# EAGLE schematic FishTankControllerV2 (EAGLE 9.6.2)
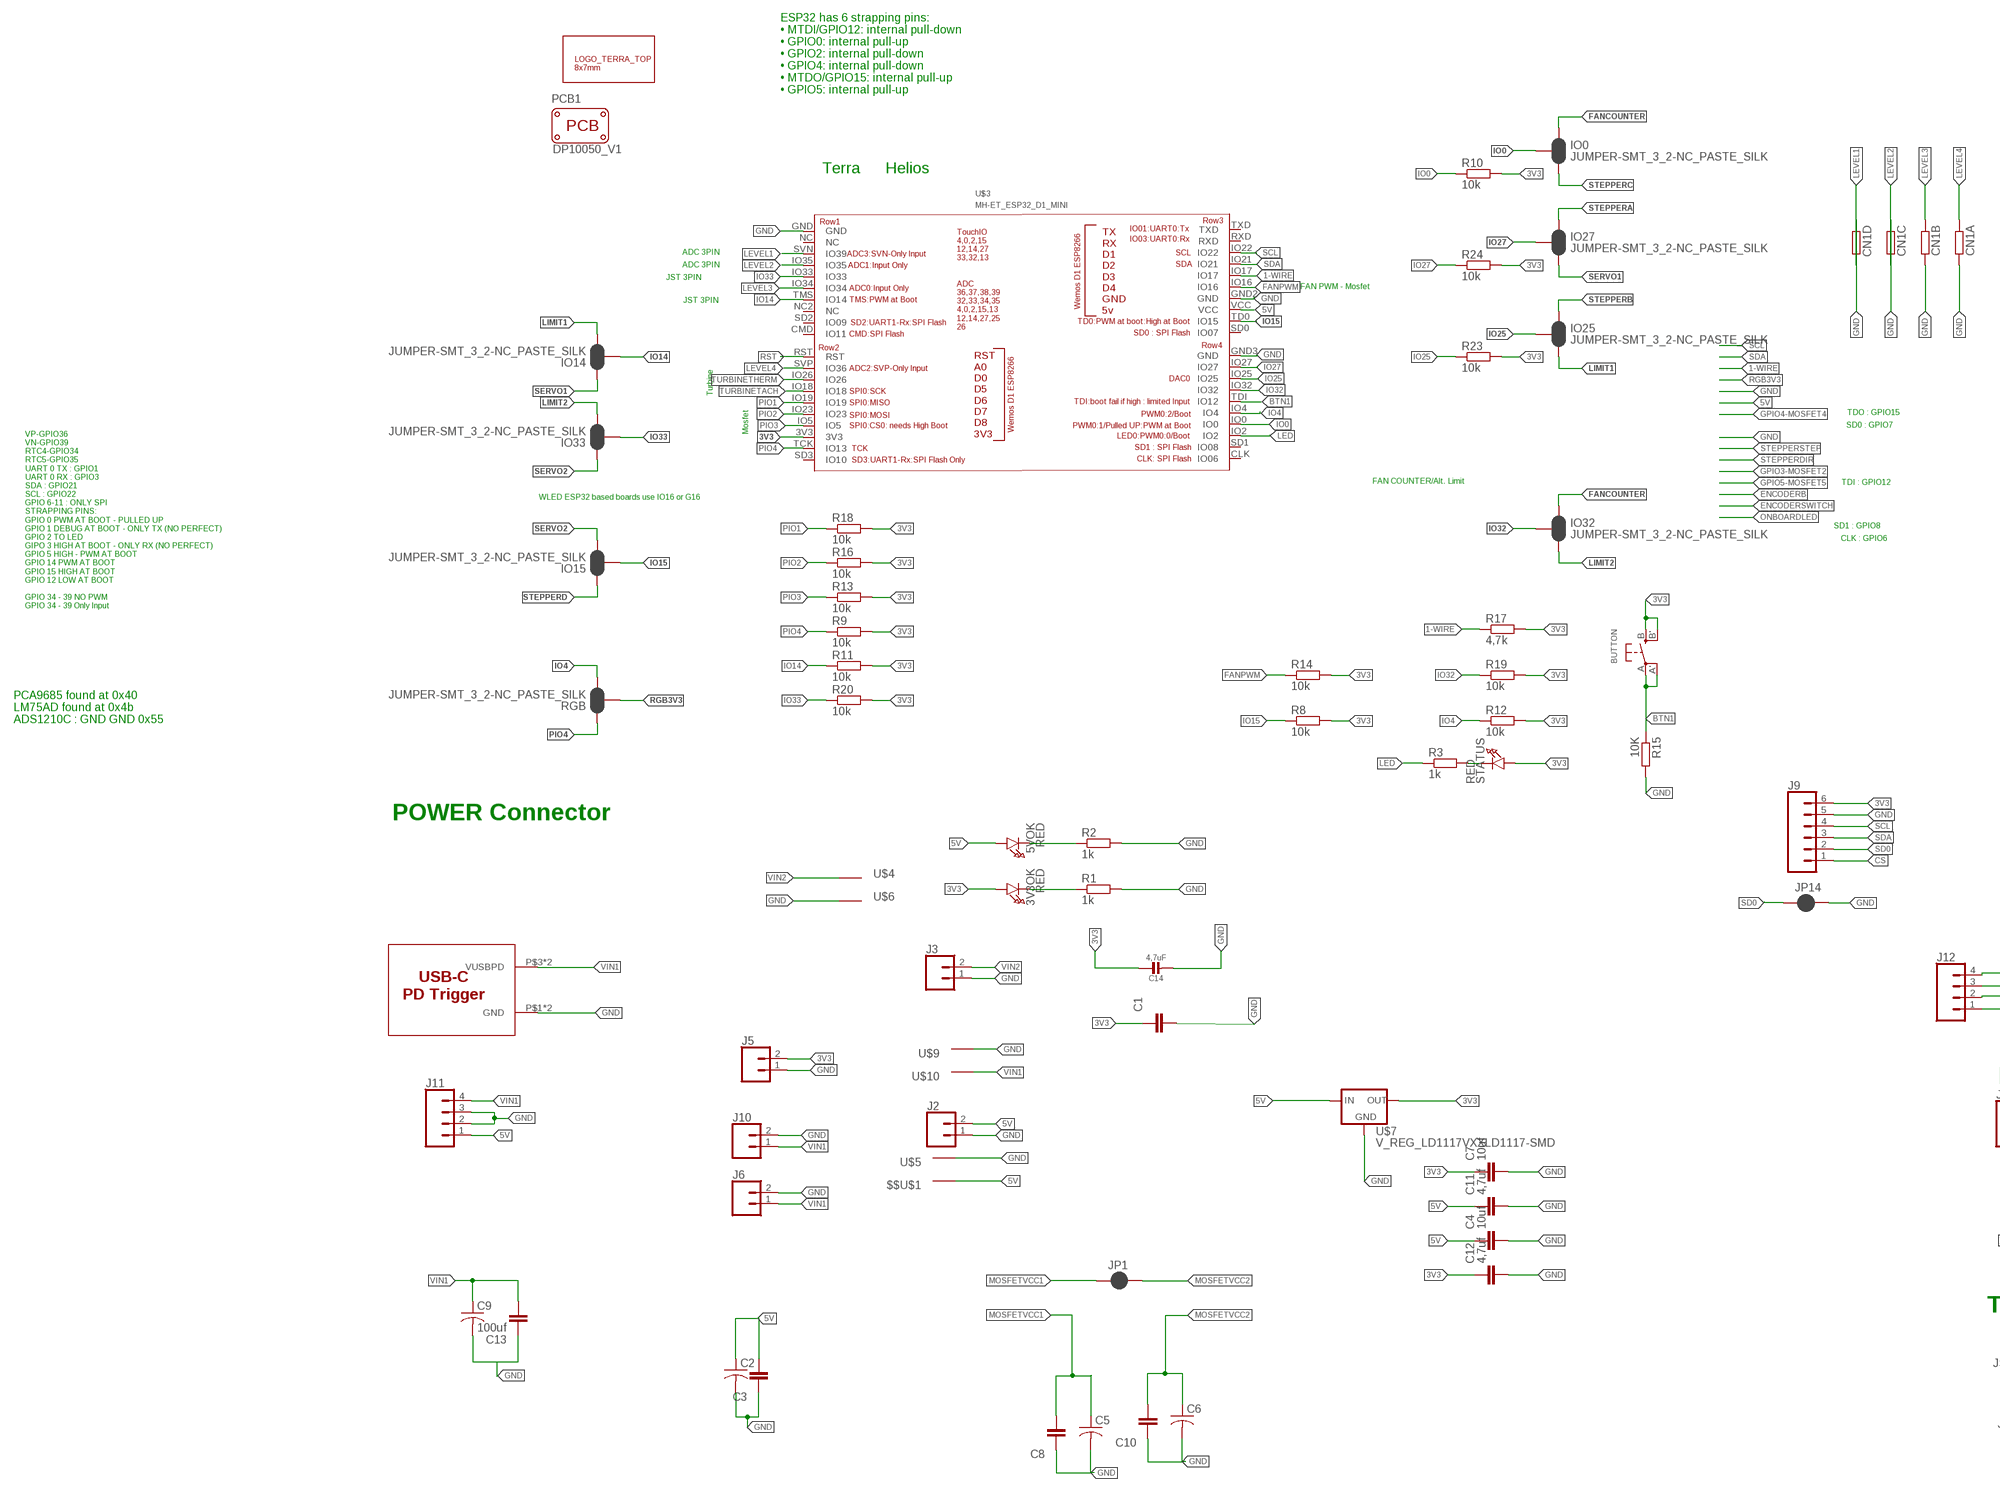
[diagram p0: schematic, sheet 1, part 1 of 2]
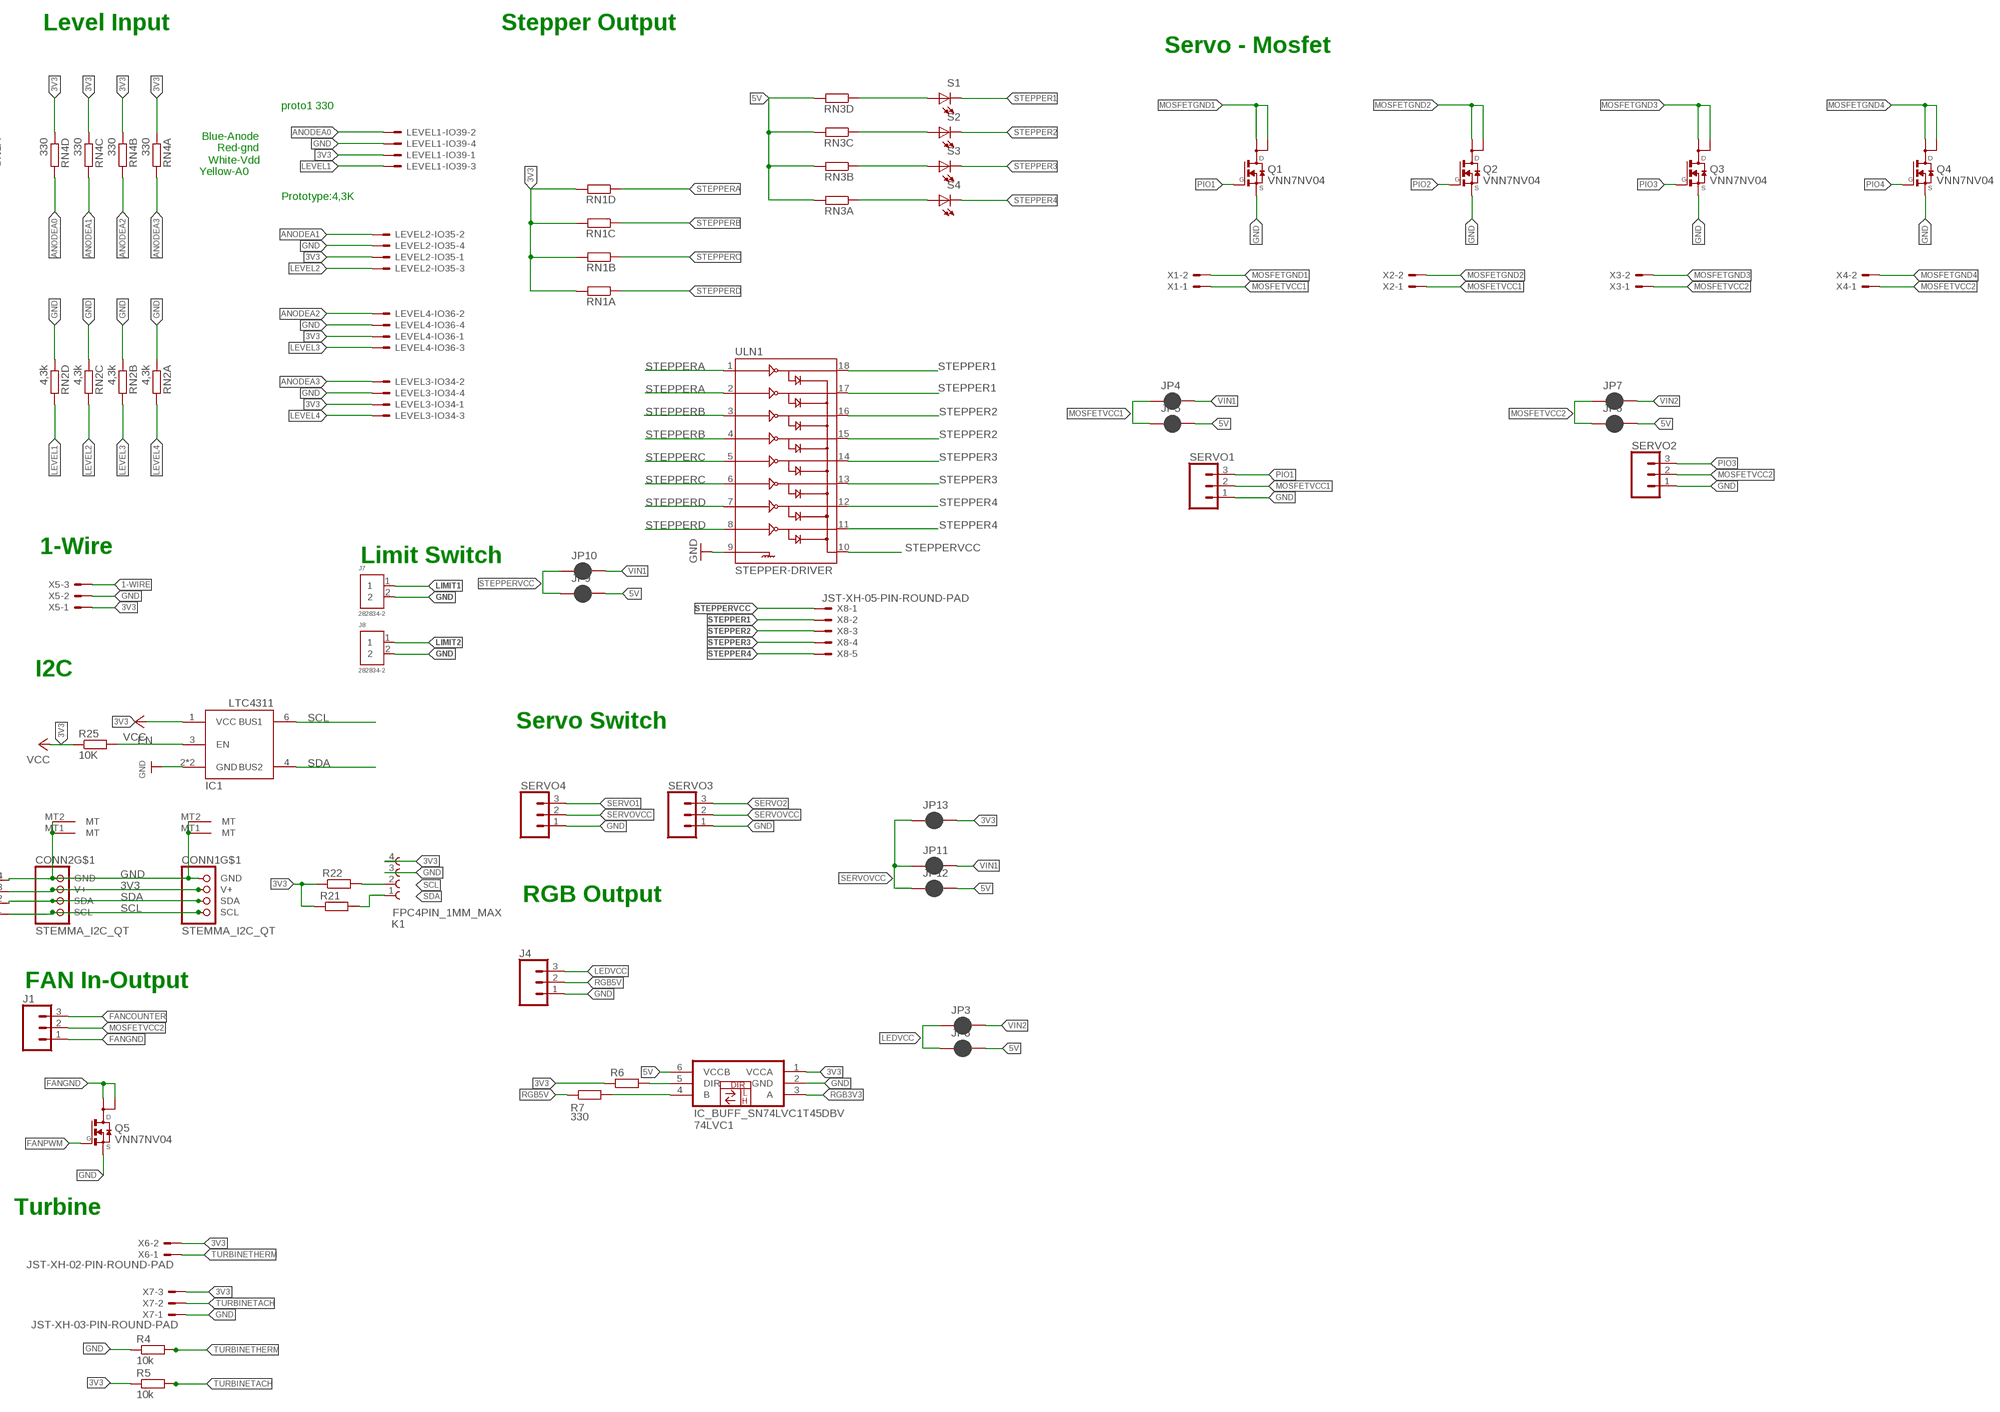
[diagram p1: schematic, sheet 1, part 2 of 2]

## Parts
3V3OK  RED  LED0805  [CHIPLED_0805]
5VOK  RED  LED0805  [CHIPLED_0805]
74LVC1  IC_BUFF_SN74LVC1T45DBV  [DBV-R-PDSO-G6]
$$U$1  TESTHOOK  [TESTHOOK]
BUTTON  KMR2  SWITCH_TACT_SMT4.6X2.8  [BTN_KMR2_4.6X2.8]
C1  CAPACITOR_NPOL-0805  [C805]
C2  C-USC1210  [C1210]
C3  CAPACITOR_NPOL-0805  [C805]
C4  10uf  CAPACITOR_NPOL-0805  [C805]
C5  C-USC1210  [C1210]
C6  C-USC1210  [C1210]
C7  10uf  CAPACITOR_NPOL-0805  [C805]
C8  CAPACITOR_NPOL-0805  [C805]
C9  100uf  C-USC1210  [C1210]
C10  CAPACITOR_NPOL-0805  [C805]
C11  4,7uf  CAPACITOR_NPOL-0805  [C805]
C12  4,7uf  CAPACITOR_NPOL-0805  [C805]
C13  CAPACITOR_NPOL-0805  [C805]
C14  4,7uF  CAP_CERAMIC0805-NOOUTLINE  [0805-NO]
CN1  RESISTOR_ARRAY_4  [RN8P-4R-CRA06S]
CONN1  STEMMA_I2C_QT  [JST_SH4]
CONN2  STEMMA_I2C_QT  [JST_SH4]
IC1  LTC4311_SC70  [SC70-6L]
IO0  JUMPER-SMT_3_2-NC_PASTE_SILK  [SMT-JUMPER_3_2-NC_PASTE_SILK]
IO14  JUMPER-SMT_3_2-NC_PASTE_SILK  [SMT-JUMPER_3_2-NC_PASTE_SILK]
IO15  JUMPER-SMT_3_2-NC_PASTE_SILK  [SMT-JUMPER_3_2-NC_PASTE_SILK]
IO25  JUMPER-SMT_3_2-NC_PASTE_SILK  [SMT-JUMPER_3_2-NC_PASTE_SILK]
IO27  JUMPER-SMT_3_2-NC_PASTE_SILK  [SMT-JUMPER_3_2-NC_PASTE_SILK]
IO32  JUMPER-SMT_3_2-NC_PASTE_SILK  [SMT-JUMPER_3_2-NC_PASTE_SILK]
IO33  JUMPER-SMT_3_2-NC_PASTE_SILK  [SMT-JUMPER_3_2-NC_PASTE_SILK]
J1  CONN_03POLAR  [MOLEX-1X3]
J2  CONN_02POLAR  [MOLEX-1X2]
J3  CONN_02POLAR  [MOLEX-1X2]
J4  CONN_03SCREW  [SCREWTERMINAL-3.5MM-3]
J5  CONN_02POLAR  [MOLEX-1X2]
J6  CONN_023.5MM  [SCREWTERMINAL-3.5MM-2]
J7  282834-2  [CONN_282834-2]
J8  282834-2  [CONN_282834-2]
J9  CONN_06NO_SILK_FEMALE_PTH  [1X06_NO_SILK]
J10  CONN_023.5MM  [SCREWTERMINAL-3.5MM-2]
J11  CONN_04  [1X04]
J12  CONN_04JST-PH-4-1.0MM  [JST-4-SMD-VERT-1.0MM]
JP1  JUMPER-SMT_2_NC_PASTE_SILK  [SMT-JUMPER_2_NC_PASTE_SILK]
JP3  JUMPER-SMT_2_NC_PASTE_SILK  [SMT-JUMPER_2_NC_PASTE_SILK]
JP4  JUMPER-SMT_2_NC_PASTE_SILK  [SMT-JUMPER_2_NC_PASTE_SILK]
JP5  JUMPER-SMT_2_NC_PASTE_SILK  [SMT-JUMPER_2_NC_PASTE_SILK]
JP6  JUMPER-SMT_2_NC_PASTE_SILK  [SMT-JUMPER_2_NC_PASTE_SILK]
JP7  JUMPER-SMT_2_NC_PASTE_SILK  [SMT-JUMPER_2_NC_PASTE_SILK]
JP8  JUMPER-SMT_2_NC_PASTE_SILK  [SMT-JUMPER_2_NC_PASTE_SILK]
JP9  JUMPER-SMT_2_NC_PASTE_SILK  [SMT-JUMPER_2_NC_PASTE_SILK]
JP10  JUMPER-SMT_2_NC_PASTE_SILK  [SMT-JUMPER_2_NC_PASTE_SILK]
JP11  JUMPER-SMT_2_NC_PASTE_SILK  [SMT-JUMPER_2_NC_PASTE_SILK]
JP12  JUMPER-SMT_2_NC_PASTE_SILK  [SMT-JUMPER_2_NC_PASTE_SILK]
JP13  JUMPER-SMT_2_NC_PASTE_SILK  [SMT-JUMPER_2_NC_PASTE_SILK]
JP14  JUMPER-SMT_2_NC_PASTE_SILK  [SMT-JUMPER_2_NC_PASTE_SILK]
K1  FPC4PIN_1MM_MAX  [FPC_CONN_DOC_4PIN_ENLARGED]
LEVEL1-IO39  JST-XH-04-PIN-ROUND-PAD  [JST-XH-04-PACKAGE-ROUND-PAD]
LEVEL2-IO35  JST-XH-04-PIN-ROUND-PAD  [JST-XH-04-PACKAGE-ROUND-PAD]
LEVEL3-IO34  JST-XH-04-PIN-ROUND-PAD  [JST-XH-04-PACKAGE-ROUND-PAD]
LEVEL4-IO36  JST-XH-04-PIN-ROUND-PAD  [JST-XH-04-PACKAGE-ROUND-PAD]
PCB1  PCB_DP_RECTANGLE-50X100  [DP10050_V1]
Q1  VNN7NV04  [SOT223]
Q2  VNN7NV04  [SOT223]
Q3  VNN7NV04  [SOT223]
Q4  VNN7NV04  [SOT223]
Q5  VNN7NV04  [SOT223]
R1  1k  RESISTORR805-0805  [R805]
R2  1k  RESISTORR805-0805  [R805]
R3  1k  RESISTORR805-0805  [R805]
R4  10k  RESISTORR805-0805  [R805]
R5  10k  RESISTORR805-0805  [R805]
R6  RESISTORR805-0805  [R805]
R7  330  RESISTORR805-0805  [R805]
R8  10k  RESISTORR805-0805  [R805]
R9  10k  RESISTORR805-0805  [R805]
R10  10k  RESISTORR805-0805  [R805]
R11  10k  RESISTORR805-0805  [R805]
R12  10k  RESISTORR805-0805  [R805]
R13  10k  RESISTORR805-0805  [R805]
R14  10k  RESISTORR805-0805  [R805]
R15  10K  RESISTORR805-0805  [R805]
R16  10k  RESISTORR805-0805  [R805]
R17  4,7k  RESISTORR805-0805  [R805]
R18  10k  RESISTORR805-0805  [R805]
R19  10k  RESISTORR805-0805  [R805]
R20  10k  RESISTORR805-0805  [R805]
R21  RESISTORR805-0805  [R805]
R22  RESISTORR805-0805  [R805]
R23  10k  RESISTORR805-0805  [R805]
R24  10k  RESISTORR805-0805  [R805]
R25  10K  RESISTORR805-0805  [R805]
RGB  JUMPER-SMT_3_2-NC_PASTE_SILK  [SMT-JUMPER_3_2-NC_PASTE_SILK]
RN1  RESISTOR_ARRAY_4  [RN8P-4R-CRA06S]
RN2  4,3k  RESISTOR_ARRAY_4  [RN8P-4R-CRA06S]
RN3  RESISTOR_ARRAY_4  [RN8P-4R-CRA06S]
RN4  330  RESISTOR_ARRAY_4  [RN8P-4R-CRA06S]
S1  LED-0805  [LED-805]
S2  LED-0805  [LED-805]
S3  LED-0805  [LED-805]
S4  LED-0805  [LED-805]
SERVO1  CONN_03POLAR  [MOLEX-1X3]
SERVO2  CONN_03POLAR  [MOLEX-1X3]
SERVO3  CONN_03POLAR  [MOLEX-1X3]
SERVO4  CONN_03POLAR  [MOLEX-1X3]
STATUS  RED  LED0805  [CHIPLED_0805]
U$1  LOGOTOPTERRA  [LOGOTOPTERRA]
U$3  MH-ET_ESP32_D1_MINI  [MH-ET_ESP32_D1_MINI]
U$4  TESTHOOK  [TESTHOOK]
U$5  TESTHOOK  [TESTHOOK]
U$6  TESTHOOK  [TESTHOOK]
U$7  V_REG_LD1117VXXLD1117-SMD  [SOT223]
U$8  USB_PD_TRIGGER  [USB-PDTRIGGER]
U$9  TESTHOOK  [TESTHOOK]
U$10  TESTHOOK  [TESTHOOK]
ULN1  STEPPER-DRIVER  ULN2803SOICW  [SO18L]
X1  JST-XH-02-PIN-ROUND-PAD  [JST-XH-02-PACKAGE-ROUND-PAD]
X2  JST-XH-02-PIN-ROUND-PAD  [JST-XH-02-PACKAGE-ROUND-PAD]
X3  JST-XH-02-PIN-ROUND-PAD  [JST-XH-02-PACKAGE-ROUND-PAD]
X4  JST-XH-02-PIN-ROUND-PAD  [JST-XH-02-PACKAGE-ROUND-PAD]
X5  JST-XH-03-PIN-ROUND-PAD  [JST-XH-03-PACKAGE-ROUND-PAD]
X6  JST-XH-02-PIN-ROUND-PAD  [JST-XH-02-PACKAGE-ROUND-PAD]
X7  JST-XH-03-PIN-ROUND-PAD  [JST-XH-03-PACKAGE-ROUND-PAD]
X8  JST-XH-05-PIN-ROUND-PAD  [JST-XH-05-PACKAGE-ROUND-PAD]

## Nets
1-WIRE: R17.1 U$3.IO17 X5.3
3V3: 3V3OK.A 74LVC1.1(VCCA) BUTTON.B'(S1) BUTTON.B(S) C1.1 C7.1 C12.1 C14.1 CONN1.2(V+) CONN2.2(V+) IC1.1(VCC) J5.2 J9.6 J12.3 JP13.2 K1.4 LEVEL1-IO39.1 LEVEL2-IO35.1 LEVEL3-IO34.1 LEVEL4-IO36.1 R5.1 R6.1 R8.2 R9.2 R10.2 R11.2 R12.2 R13.2 R14.2 R16.2 R17.2 R18.2 R19.2 R20.2 R21.1 R22.1 R23.2 R24.2 R25.1 RN1.5 RN1.6 RN1.7 RN1.8 RN4.1 RN4.2 RN4.3 RN4.4 STATUS.A U$3.3V3 U$7.2(OUT) X5.1 X6.2 X7.3 ; supply symbol labelled VCC
5V: 5VOK.A 74LVC1.6(VCCB) $$U$1.P$1 C2.1 C3.2 C4.1 C11.1 J2.2 J11.1 JP5.2 JP6.2 JP8.2 JP9.2 JP12.2 RN3.5 RN3.6 RN3.7 RN3.8 U$3.VCC U$7.3(IN)
ANODEA0: LEVEL1-IO39.2 RN4.5
ANODEA1: LEVEL2-IO35.2 RN4.6
ANODEA2: LEVEL4-IO36.2 RN4.7
ANODEA3: LEVEL3-IO34.2 RN4.8
BTN1: BUTTON.A'(P1) BUTTON.A(P) R15.1 U$3.TDI(IO12)
CS: J9.1
EN: IC1.3(EN) R25.2
FANCOUNTER: IO0.1 IO32.1 J1.3
FANGND: J1.1 Q5.2(D) Q5.4(D2)
FANPWM: Q5.1(G) R14.1 U$3.IO16
GND: 74LVC1.2(GND) C1.2 C2.2 C3.1 C4.2 C5.2 C6.2 C7.2 C8.1 C9.2 C10.1 C11.2 C12.2 C13.1 C14.2 CN1.3 CN1.4 CN1.7 CN1.8 CONN1.1(GND) CONN1.MT1(MT) CONN1.MT2(MT) CONN2.1(GND) CONN2.MT1(MT) CONN2.MT2(MT) IC1.2(GND) IC1.5(GND) J2.1 J3.1 J4.1 J5.1 J6.2 J7.2 J8.2 J9.5 J10.2 J11.2 J11.3 J12.4 JP14.2 K1.3 LEVEL1-IO39.4 LEVEL2-IO35.4 LEVEL3-IO34.4 LEVEL4-IO36.4 Q1.3(S) Q2.3(S) Q3.3(S) Q4.3(S) Q5.3(S) R1.2 R2.2 R4.1 R15.2 RN2.1 RN2.2 RN2.3 RN2.4 SERVO1.1 SERVO2.1 SERVO3.1 SERVO4.1 U$3.GND U$3.GND2(GND) U$3.GND3(GND) U$5.P$1 U$6.P$1 U$7.1(GND) U$8.P$1(GND) U$8.P$2(GND) U$9.P$1 ULN1.9 X5.2 X7.1
IO0: IO0.2 R10.1 U$3.IO0
IO4: R12.1 RGB.3 U$3.IO4
IO14: IO14.2 R11.1 U$3.TMS(IO14)
IO15: IO15.2 R8.1 U$3.TD0(IO15)
IO25: IO25.2 R23.1 U$3.IO25
IO27: IO27.2 R24.1 U$3.IO27
IO32: IO32.2 R19.1 U$3.IO32
IO33: IO33.2 R20.1 U$3.IO33
LED: R3.1 U$3.IO2
LEDVCC: J4.3 JP3.1 JP8.1
LEVEL1: CN1.5 LEVEL1-IO39.3 RN2.5 U$3.SVN(IO39)
LEVEL2: CN1.6 LEVEL2-IO35.3 RN2.6 U$3.IO35
LEVEL3: CN1.2 LEVEL4-IO36.3 RN2.7 U$3.IO34
LEVEL4: CN1.1 LEVEL3-IO34.3 RN2.8 U$3.SVP(IO36)
LIMIT1: IO14.3 IO25.3 J7.1
LIMIT2: IO32.3 IO33.3 J8.1
MOSFETGND1: Q1.2(D) Q1.4(D2) X1.2
MOSFETGND2: Q2.2(D) Q2.4(D2) X2.2
MOSFETGND3: Q3.2(D) Q3.4(D2) X3.2
MOSFETGND4: Q4.2(D) Q4.4(D2) X4.2
MOSFETVCC1: C5.1 C8.2 JP1.1 JP4.1 JP5.1 SERVO1.2 X1.1 X2.1
MOSFETVCC2: C6.1 C10.2 J1.2 JP1.2 JP6.1 JP7.1 SERVO2.2 X3.1 X4.1
N$1: 5VOK.C R2.1
N$2: R3.2 STATUS.C
N$6: 3V3OK.C R1.1
N$10: RN3.4 S1.A
N$11: RN3.3 S2.A
N$12: RN3.2 S3.A
N$13: RN3.1 S4.A
N$52: 74LVC1.5(DIR) R6.2
N$74: 74LVC1.4(B) R7.2
PIO1: Q1.1(G) R18.1 SERVO1.3 U$3.IO19
PIO2: Q2.1(G) R16.1 U$3.IO23
PIO3: Q3.1(G) R13.1 SERVO2.3 U$3.IO5
PIO4: Q4.1(G) R9.1 RGB.1 U$3.TCK(IO13)
RGB3V3: 74LVC1.3(A) RGB.2
RGB5V: J4.2 R7.1
RST: U$3.RST
SCL: CONN1.4(SCL) CONN2.4(SCL) IC1.6(BUS1) J9.4 J12.1 K1.2 R22.2 U$3.IO22
SD0: J9.2 JP14.1
SDA: CONN1.3(SDA) CONN2.3(SDA) IC1.4(BUS2) J9.3 J12.2 K1.1 R21.2 U$3.IO21
SERVO1: IO14.1 IO27.3 SERVO4.3
SERVO2: IO15.3 IO33.1 SERVO3.3
SERVOVCC: JP11.1 JP12.1 JP13.1 SERVO3.2 SERVO4.2
STEPPER1: S1.C ULN1.17 ULN1.18 X8.2
STEPPER2: S2.C ULN1.15 ULN1.16 X8.3
STEPPER3: S3.C ULN1.13 ULN1.14 X8.4
STEPPER4: S4.C ULN1.11 ULN1.12 X8.5
STEPPERA: IO27.1 RN1.4 ULN1.1 ULN1.2
STEPPERB: IO25.1 RN1.3 ULN1.3 ULN1.4
STEPPERC: IO0.3 RN1.2 ULN1.5 ULN1.6
STEPPERD: IO15.1 RN1.1 ULN1.7 ULN1.8
STEPPERVCC: JP9.1 JP10.1 ULN1.10 X8.1
TURBINETACH: R5.2 U$3.IO18 X7.2
TURBINETHERM: R4.2 U$3.IO26 X6.1
VIN1: C9.1 C13.2 J6.1 J10.1 J11.4 JP4.2 JP10.2 JP11.2 U$8.P$3(VUSBPD) U$8.P$4(VUSBPD) U$10.P$1
VIN2: J3.2 JP3.2 JP7.2 U$4.P$1
Unconnected: U$3.CLK(IO06) U$3.CMD(IO11) U$3.NC U$3.NC2(NC) U$3.RXD U$3.SD0(IO07) U$3.SD1(IO08) U$3.SD2(IO09) U$3.SD3(IO10) U$3.TXD

## Notes on the sheet
- ESP32 has 6 strapping pins: 
  • MTDI/GPIO12: internal pull-down 
  • GPIO0: internal pull-up 
  • GPIO2: internal pull-down 
  • GPIO4: internal pull-down 
  • MTDO/GPIO15: internal pull-up 
  • GPIO5: internal pull-up
- Level Input | Stepper Output
- Servo - Mosfet
- Terra | Helios
- proto1 330
- Blue-Anode
- Red-gnd
- White-Vdd
- ADC 3PIN
- Yellow-A0
- ADC 3PIN
- JST 3PIN
- FAN PWM - Mosfet | Prototype:4,3K
- JST 3PIN
- Turbine
- Mosfet | TDO : GPIO15
- SD0 : GPIO7
- TDI : GPIO12
- FAN COUNTER/Alt. Limit
- WLED ESP32 based boards use IO16 or G16
- SD1 : GPIO8
- CLK : GPIO6
- VP-GPIO36
  VN-GPIO39
  RTC4-GPIO34
  RTC5-GPIO35
  UART 0 TX : GPIO1
  UART 0 RX : GPIO3
  SDA : GPIO21
  SCL : GPIO22
  GPIO 6-11 : ONLY SPI
  STRAPPING PINS:
  GPIO 0 PWM AT BOOT - PULLED UP
  GPIO 1 DEBUG AT BOOT - ONLY TX (NO PERFECT)
  GPIO 2 TO LED
  GIPO 3 HIGH AT BOOT - ONLY RX (NO PERFECT)
  GPIO 5 HIGH - PWM AT BOOT
  GPIO 14 PWM AT BOOT
  GPIO 15 HIGH AT BOOT
  GPIO 12 LOW AT BOOT
  
  GPIO 34 - 39 NO PWM
  GPIO 34 - 39 Only Input
- 1-Wire
- Limit Switch
- PCA9685 found at 0x40
  LM75AD found at 0x4b
  ADS1210C : GND GND 0x55
- I2C
- POWER Connector | Servo Switch
- RGB Output
- FAN In-Output
- Turbine

## Library data of the parts
3V3OK 5VOK STATUS = microbuilder:LED: LED 0603 - 0603 Surface Mount Package 2mA: Green LED - Low Power (3.9mcd, 2ma, 1.7Vf) - Digikey: 475-2709-2-ND Orange LED - Low Power (9.8mcd, 2ma, 1.8Vf) - Digikey: 475-1194-2-ND Red LED - Low Power (5mcd, 2ma, 1.8Vf) - Digikey: 475-1195-2-ND Yellow LED - Low Power (7mcd, 2ma, 1.8Vf) - Digikey: 475-1196-2-ND 5mA: Blue LED - Low Power (17mcd, 5ma, 2.9Vf) - Digikey: LNJ937W8CRACT-ND 0805 - 0805 Surface Mount Package 2mA: Red LED (8.8mcd, 2mA, 1.8Vf, Clear) - Low Power [Digikey: 475-2510-1-ND] Green LED (5mcd, 2mA, 1.8Vf, Clear) - Low Power [Digikey: 475-2730-1-ND] Yellow LED (11.3mcd, 2mA, 1.8Vf, Clear) - Low Power [Digikey: 475-2555-1-ND] 20mA: Red LED (104mcd, 20mA, Diffused) - LS R976 [Digikey: 475-1278-6-ND] Red LED (12mcd, 20mA, 2.0Vf, Clear) - APT2012EC [Digikey: 754-1128-1-ND] Green LED (15mcd, 20mA, 2.2Vf, Clear) - APT2012GC [Digikey: 754-1131-1-ND] Orange LED (160mcd, 20mA, 2.1Vf, Clear) - APT2012SECK [Digikey: 754-1130-1-ND] 1206 - 1206 Surface Mount Package Green LED (26mcd, 20mA, Diffused) - LG N971 [Digikey: 475-1407-6-ND] Red LED (15mcd, 20mA, Diffused) - LH N974 [Digikey: 475-1416-6-ND]
74LVC1 = dp_devices:IC_BUFF_SN74LVC1T45DBV
$$U$1 U$4-U$6 U$9 U$10 = pimoroni-connectors:TESTHOOK
BUTTON = microbuilder:SWITCH_TACT_SMT: SMT Tact Switches 6x6mm - Digikey: P12940SCT-ND KMR2 (4.6x2.8mm) - Digikey: 401-1426-1-ND EVQ-PQHB55 - Light Touch, 160GF (4.5x4.5mm) - Digikey: P8090SCT-ND
C1 C3 C4 C7 C8 C10-C13 = dp_devices:CAPACITOR_NPOL: Non-Polarized capacitor in various packages
C2 C5 C6 C9 = adafruit:C-US: CAPACITOR, American symbol
C14 = microbuilder:CAP_CERAMIC: Ceramic Capacitors For new designs, use the packages preceded by an '_' character since they are more reliable: The following footprints should be used on most boards: _0402 - Standard footprint for regular board layouts _0603 - Standard footprint for regular board layouts _0805 - Standard footprint for regular board layouts _1206 - Standard footprint for regular board layouts For extremely tight-pitch boards where space is at a premium, the following 'micro-pitch' footprints can be used (smaller pads, no silkscreen outline, etc.): _0402MP - Micro-pitch footprint for very dense/compact boards _0603MP - Micro-pitch footprint for very dense/compact boards _0805MP - Micro-pitch footprint for very dense/compact boards _1206MP - Micro-pitch footprint for very dense/compact boards
CN1 RN1-RN4 = dp_devices:RESISTOR_ARRAY_4: 4 Resistor Array 0603
CONN1 CONN2 = microbuilder:STEMMA_I2C
IC1 = microbuilder:LTC4311
IO0 IO14 IO15 IO25 IO27 IO32 IO33 RGB = SparkFun-Jumpers:JUMPER-SMT_3_2-NC_PASTE: Normally closed solder jumper (2 of 2 connections) This jumper has an aperture in the stencil to allow solder paste to bridge both connections. Both connections are normally closed (NC). Wick off the solder to open the connection(s). Reapply solder to reclose the connection(s).
J1 SERVO1-SERVO4 = SparkFun-Connectors:CONN_03: Multi connection point. Often used as Generic Header-pin footprint for 0.1 inch spaced/style header connections On any of the 0.1 inch spaced packages, you can populate with these: Break Away Headers - Straight <https://www.sparkfun.com/products/116> (PRT-00116) Break Away Male Headers - Right Angle <https://www.sparkfun.com/products/553> (PRT-00553) Female Headers <https://www.sparkfun.com/products/115> (PRT-00115) Break Away Headers - Machine Pin <https://www.sparkfun.com/products/117> (PRT-00117) Break Away Female Headers - Swiss Machine Pin <https://www.sparkfun.com/products/743> (PRT-00743) Stackable Header - 3 Pin (Female, 0.1") <https://www.sparkfun.com/products/13875> (PRT-13875) For SCREWTERMINALS and SPRING TERMINALS visit here: Screw Terimnals on SparkFun.com <https://www.sparkfun.com/search/results?term=Screw+Terminals> (5mm/3.5mm/2.54mm spacing) This device is also useful as a general connection point to wire up your design to another part of your project. Our various solder wires solder well into these plated through hole pads. Hook-Up Wire - Assortment (Stranded, 22 AWG) <https://www.sparkfun.com/products/11375> (PRT-11375) Hook-Up Wire - Assortment (Solid Core, 22 AWG) <https://www.sparkfun.com/products/11367> (PRT-11367) View the entire wire category on our website here <https://www.sparkfun.com/categories/141> Special notes: Molex polarized connector foot print use with SKU : PRT-08232 with associated crimp pins and housings.; PROD_ID: CONN-08625; SF_ID: PRT-08096
J2 J3 J5 = SparkFun-Connectors:CONN_02: Multi connection point. Often used as Generic Header-pin footprint for 0.1 inch spaced/style header connections On any of the 0.1 inch spaced packages, you can populate with these: Break Away Headers - Straight <https://www.sparkfun.com/products/116> (PRT-00116) Break Away Male Headers - Right Angle <https://www.sparkfun.com/products/553> (PRT-00553) Female Headers <https://www.sparkfun.com/products/115> (PRT-00115) Break Away Headers - Machine Pin <https://www.sparkfun.com/products/117> (PRT-00117) Break Away Female Headers - Swiss Machine Pin <https://www.sparkfun.com/products/743> (PRT-00743) For SCREWTERMINALS and SPRING TERMINALS visit here: Screw Terimnals on SparkFun.com <https://www.sparkfun.com/search/results?term=Screw+Terminals> (5mm/3.5mm/2.54mm spacing) This device is also useful as a general connection point to wire up your design to another part of your project. Our various solder wires solder well into these plated through hole pads. Hook-Up Wire - Assortment (Stranded, 22 AWG) <https://www.sparkfun.com/products/11375> (PRT-11375) Hook-Up Wire - Assortment (Solid Core, 22 AWG) <https://www.sparkfun.com/products/11367> (PRT-11367) View the entire wire category on our website here <https://www.sparkfun.com/categories/141> Special notes: Molex polarized connector foot print use with: PRT-08233 with associated crimp pins and housings. 2.54_SCREWTERM for use with PRT-10571. 3.5mm Screw Terminal footprints for PRT-08084 5mm Screw Terminal footprints for use with PRT-08432; SF_ID: PRT-09918
J4 = SparkFun-Connectors:CONN_03: Multi connection point. Often used as Generic Header-pin footprint for 0.1 inch spaced/style header connections On any of the 0.1 inch spaced packages, you can populate with these: Break Away Headers - Straight <https://www.sparkfun.com/products/116> (PRT-00116) Break Away Male Headers - Right Angle <https://www.sparkfun.com/products/553> (PRT-00553) Female Headers <https://www.sparkfun.com/products/115> (PRT-00115) Break Away Headers - Machine Pin <https://www.sparkfun.com/products/117> (PRT-00117) Break Away Female Headers - Swiss Machine Pin <https://www.sparkfun.com/products/743> (PRT-00743) Stackable Header - 3 Pin (Female, 0.1") <https://www.sparkfun.com/products/13875> (PRT-13875) For SCREWTERMINALS and SPRING TERMINALS visit here: Screw Terimnals on SparkFun.com <https://www.sparkfun.com/search/results?term=Screw+Terminals> (5mm/3.5mm/2.54mm spacing) This device is also useful as a general connection point to wire up your design to another part of your project. Our various solder wires solder well into these plated through hole pads. Hook-Up Wire - Assortment (Stranded, 22 AWG) <https://www.sparkfun.com/products/11375> (PRT-11375) Hook-Up Wire - Assortment (Solid Core, 22 AWG) <https://www.sparkfun.com/products/11367> (PRT-11367) View the entire wire category on our website here <https://www.sparkfun.com/categories/141> Special notes: Molex polarized connector foot print use with SKU : PRT-08232 with associated crimp pins and housings.; PROD_ID: CONN-08288; SF_ID: PRT-08235
J6 J10 = SparkFun-Connectors:CONN_02: Multi connection point. Often used as Generic Header-pin footprint for 0.1 inch spaced/style header connections On any of the 0.1 inch spaced packages, you can populate with these: Break Away Headers - Straight <https://www.sparkfun.com/products/116> (PRT-00116) Break Away Male Headers - Right Angle <https://www.sparkfun.com/products/553> (PRT-00553) Female Headers <https://www.sparkfun.com/products/115> (PRT-00115) Break Away Headers - Machine Pin <https://www.sparkfun.com/products/117> (PRT-00117) Break Away Female Headers - Swiss Machine Pin <https://www.sparkfun.com/products/743> (PRT-00743) For SCREWTERMINALS and SPRING TERMINALS visit here: Screw Terimnals on SparkFun.com <https://www.sparkfun.com/search/results?term=Screw+Terminals> (5mm/3.5mm/2.54mm spacing) This device is also useful as a general connection point to wire up your design to another part of your project. Our various solder wires solder well into these plated through hole pads. Hook-Up Wire - Assortment (Stranded, 22 AWG) <https://www.sparkfun.com/products/11375> (PRT-11375) Hook-Up Wire - Assortment (Solid Core, 22 AWG) <https://www.sparkfun.com/products/11367> (PRT-11367) View the entire wire category on our website here <https://www.sparkfun.com/categories/141> Special notes: Molex polarized connector foot print use with: PRT-08233 with associated crimp pins and housings. 2.54_SCREWTERM for use with PRT-10571. 3.5mm Screw Terminal footprints for PRT-08084 5mm Screw Terminal footprints for use with PRT-08432; PROD_ID: CONN-08399
J7 J8 = 282834-2:282834-2: Terminal block; 2.54mm; angled 90°; 0.03÷1mm2; ways: 2; 10A; H: 10mm Check prices <https://pricing.snapeda.com/parts/282834-2/TE%20Connectivity/view-part?ref=eda>; AVAILABILITY: In Stock; CENTERLINE_PITCH: 2.54 mm[.1 in]; COMMENT: 282834-2; DESCRIPTION: Wire-To-Board Terminal Block, 2, 150 V, 10 A, 30 Awg, 16 Awg, 1.4 Mm; EU_ROHS_COMPLIANCE: Compliant with Exemptions; MF: TE Connectivity; MP: 282834-2; NUMBER_OF_POSITIONS: 2; PACKAGE: None; PRICE: None; PURCHASE-URL: https://pricing.snapeda.com/search/part/282834-2/?ref=eda
J9 = SparkFun-Connectors:CONN_06: Multi connection point. Often used as Generic Header-pin footprint for 0.1 inch spaced/style header connections On any of the 0.1 inch spaced packages, you can populate with these: Break Away Headers - Straight <https://www.sparkfun.com/products/116> (PRT-00116) Break Away Male Headers - Right Angle <https://www.sparkfun.com/products/553> (PRT-00553) Female Headers <https://www.sparkfun.com/products/115> (PRT-00115) Break Away Headers - Machine Pin <https://www.sparkfun.com/products/117> (PRT-00117) Break Away Female Headers - Swiss Machine Pin <https://www.sparkfun.com/products/743> (PRT-00743) Arduino Stackable Header - 6 Pin <https://www.sparkfun.com/products/9280> (PRT-09280) For SCREWTERMINALS and SPRING TERMINALS visit here: Screw Terimnals on SparkFun.com <https://www.sparkfun.com/search/results?term=Screw+Terminals> (5mm/3.5mm/2.54mm spacing) This device is also useful as a general connection point to wire up your design to another part of your project. Our various solder wires solder well into these plated through hole pads. Hook-Up Wire - Assortment (Stranded, 22 AWG) <https://www.sparkfun.com/products/11375> (PRT-11375) Hook-Up Wire - Assortment (Solid Core, 22 AWG) <https://www.sparkfun.com/products/11367> (PRT-11367) View the entire wire category on our website here <https://www.sparkfun.com/categories/141>; PROD_ID: CONN-08437
J11 = SparkFun-Connectors:CONN_04: Multi connection point. Often used as Generic Header-pin footprint for 0.1 inch spaced/style header connections On any of the 0.1 inch spaced packages, you can populate with these: Break Away Headers - Straight <https://www.sparkfun.com/products/116> (PRT-00116) Break Away Male Headers - Right Angle <https://www.sparkfun.com/products/553> (PRT-00553) Female Headers <https://www.sparkfun.com/products/115> (PRT-00115) Break Away Headers - Machine Pin <https://www.sparkfun.com/products/117> (PRT-00117) Break Away Female Headers - Swiss Machine Pin <https://www.sparkfun.com/products/743> (PRT-00743) For SCREWTERMINALS and SPRING TERMINALS visit here: Screw Terimnals on SparkFun.com <https://www.sparkfun.com/search/results?term=Screw+Terminals> (5mm/3.5mm/2.54mm spacing) This device is also useful as a general connection point to wire up your design to another part of your project. Our various solder wires solder well into these plated through hole pads. Hook-Up Wire - Assortment (Stranded, 22 AWG) <https://www.sparkfun.com/products/11375> (PRT-11375) Hook-Up Wire - Assortment (Solid Core, 22 AWG) <https://www.sparkfun.com/products/11367> (PRT-11367) View the entire wire category on our website here <https://www.sparkfun.com/categories/141> Special notes: Molex polarized connector foot print use with SKU : PRT-08231 with associated crimp pins and housings. 1MM SMD Version SKU: PRT-10208; PROD_ID: CONN-09696
J12 = SparkFun-Connectors:CONN_04: Multi connection point. Often used as Generic Header-pin footprint for 0.1 inch spaced/style header connections On any of the 0.1 inch spaced packages, you can populate with these: Break Away Headers - Straight <https://www.sparkfun.com/products/116> (PRT-00116) Break Away Male Headers - Right Angle <https://www.sparkfun.com/products/553> (PRT-00553) Female Headers <https://www.sparkfun.com/products/115> (PRT-00115) Break Away Headers - Machine Pin <https://www.sparkfun.com/products/117> (PRT-00117) Break Away Female Headers - Swiss Machine Pin <https://www.sparkfun.com/products/743> (PRT-00743) For SCREWTERMINALS and SPRING TERMINALS visit here: Screw Terimnals on SparkFun.com <https://www.sparkfun.com/search/results?term=Screw+Terminals> (5mm/3.5mm/2.54mm spacing) This device is also useful as a general connection point to wire up your design to another part of your project. Our various solder wires solder well into these plated through hole pads. Hook-Up Wire - Assortment (Stranded, 22 AWG) <https://www.sparkfun.com/products/11375> (PRT-11375) Hook-Up Wire - Assortment (Solid Core, 22 AWG) <https://www.sparkfun.com/products/11367> (PRT-11367) View the entire wire category on our website here <https://www.sparkfun.com/categories/141> Special notes: Molex polarized connector foot print use with SKU : PRT-08231 with associated crimp pins and housings. 1MM SMD Version SKU: PRT-10208
JP1 JP3-JP14 = SparkFun-Jumpers:JUMPER-SMT_2_NC_PASTE: Normally closed solder jumper This jumper has an aperture in the stencil to allow solder paste to bridge the split in the wire so it's normally closed (NC). Wick off the solder to open the connection. Reapply solder to reclose the connection.
K1 = FPCMax:FPC4PIN_1MM_MAX: WR-FPC 1.00mm SMT ZIF Horizontal Bottom Contact, 4 Pins=>Code : Con_FPC_ZIF_1.00_68610414422 <http://katalog.we-online.de/media/images/eican/Con_FPC_ZIF_1.00_6861xx14422_pf2.jpg> Details see: http://katalog.we-online.de/en/em/686_1xx_144_22 Created 2014-07-09, Karrer Zheng 2014 (C) Würth Elektronik
LEVEL1-IO39 LEVEL2-IO35 LEVEL3-IO34 LEVEL4-IO36 = Rembrandt Electronics - JST XH Connectors v1-0:JST-XH-04-PIN: JST XH Connector 2 Pin Wire to board connector. Pitch: 2,54 mm, (0.100") Number of pins: 4 Created by Rembrandt Electronics www.rembrandtelectronics.com
PCB1 = dp_devices:PCB_DP_RECTANGLE: Dangerous Prototypes Standard Rectangular PCB sizes; PCB_SIZE: DP10050_V1
Q1-Q5 = VNN7NV04:VNN7NV04: POWER MOSFET N-CH OMNIFET-II 40V 6A SOT223; AVAILABILITY: Unavailable; DESCRIPTION: Power Switch/Driver 1:1 N-Channel 6A SOT-223; MF: STMicroelectronics; MP: VNN7NV04; PACKAGE: None; PRICE: None
R1-R25 = dp_devices:RESISTOR
S1-S4 = dp_devices:LED: Light Emitting Diode
U$1 = MyBreadBoards:LOGOTOPTERRA
U$3 = MH-ET_ESP32_D1_MINI:MH-ET_ESP32_D1_MINI
U$7 = SparkFun-IC-Power:V_REG_LD1117VXX: LD1117VXX voltage regulator. We carry the 3.3V version (COM-00526) in TO-220 package.; PROD_ID: VREG-13917
U$8 = MyBreadBoards:USB_PD_TRIGGER
ULN1 = SparkFun-PowerIC:ULN2803: Darlington Driver ULN2803 Darlington array. 500mA max per channel, 8-channel package. Spark Fun Electronics SKU : COM-00312
X1-X4 X6 = Rembrandt Electronics - JST XH Connectors v1-0:JST-XH-02-PIN: JST XH Connector 2 Pin Wire to board connector. Pitch: 2,54 mm, (0.100") Number of pins: 2 Created by Rembrandt Electronics www.rembrandtelectronics.com
X5 X7 = Rembrandt Electronics - JST XH Connectors v1-0:JST-XH-03-PIN: JST XH Connector 2 Pin Wire to board connector. Pitch: 2,54 mm, (0.100") Number of pins: 3 Created by Rembrandt Electronics www.rembrandtelectronics.com
X8 = Rembrandt Electronics - JST XH Connectors v1-0:JST-XH-05-PIN: JST XH Connector 2 Pin Wire to board connector. Pitch: 2,54 mm, (0.100") Number of pins: 5 Created by Rembrandt Electronics www.rembrandtelectronics.com

## Net classes
0 default: clearance 0.127 mm
1 power: width 0.127 mm, drill 0.305 mm
2 lowpower: width 0.254 mm, drill 0.483 mm
3 usbvcc: width 0.127 mm, drill 0.305 mm, clearance 0.254 mm to class 0, clearance 0.254 mm to class 1, clearance 0.254 mm to class 2, clearance 0.254 mm
4 ThermoDiode: clearance 0.025 mm